# EAGLE design UnoBot (EAGLE 9.6.2)
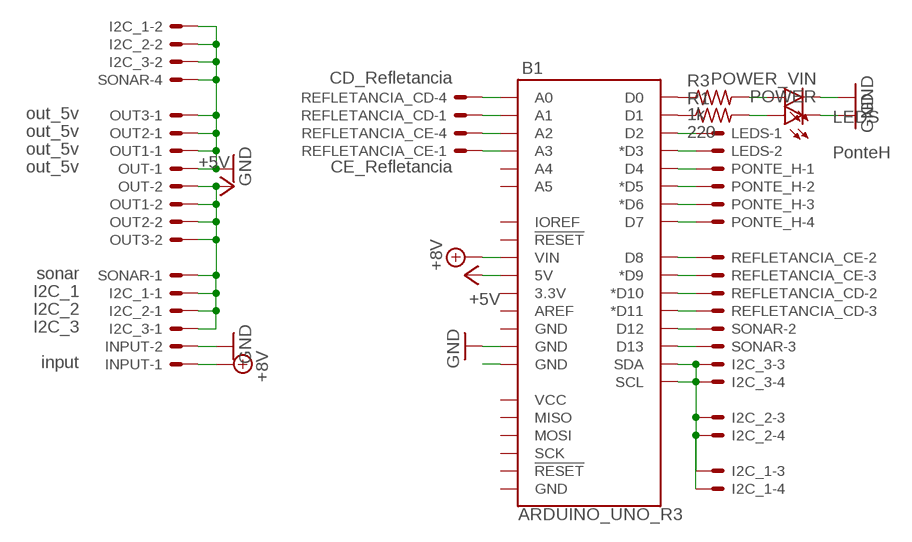
[diagram p0: schematic, sheet 1]

## Parts
B1  ARDUINO_UNO_R3  [ARDUINO_R3]
I2C_1  I2C_1  JST-XH-04-PIN-LONG-PAD  [JST-XH-04-PACKAGE-LONG-PAD]
I2C_2  I2C_2  JST-XH-04-PIN-LONG-PAD  [JST-XH-04-PACKAGE-LONG-PAD]
I2C_3  I2C_3  JST-XH-04-PIN-LONG-PAD  [JST-XH-04-PACKAGE-LONG-PAD]
INPUT  input  JST-XH-02-PIN-LONG-PAD  [JST-XH-02-PACKAGE-LONG-PAD]
LEDS  LEDS  JST-XH-02-PIN-LONG-PAD  [JST-XH-02-PACKAGE-LONG-PAD]
OUT  out_5v  JST-XH-02-PIN-LONG-PAD  [JST-XH-02-PACKAGE-LONG-PAD]
OUT1  out_5v  JST-XH-02-PIN-LONG-PAD  [JST-XH-02-PACKAGE-LONG-PAD]
OUT2  out_5v  JST-XH-02-PIN-LONG-PAD  [JST-XH-02-PACKAGE-LONG-PAD]
OUT3  out_5v  JST-XH-02-PIN-LONG-PAD  [JST-XH-02-PACKAGE-LONG-PAD]
PONTE_H  PonteH  JST-XH-04-PIN-LONG-PAD  [JST-XH-04-PACKAGE-LONG-PAD]
POWER  LEDLED5MM_LONG_PAD  [LED5MM_LONG_PAD]
POWER_VIN  LEDLED5MM_LONG_PAD  [LED5MM_LONG_PAD]
R1  220  R-US_0204/7  [0204/7]
R3  1k  R-US_0204/7  [0204/7]
REFLETANCIA_CD  CD_Refletancia  JST-XH-04-PIN-LONG-PAD  [JST-XH-04-PACKAGE-LONG-PAD]
REFLETANCIA_CE  CE_Refletancia  JST-XH-04-PIN-LONG-PAD  [JST-XH-04-PACKAGE-LONG-PAD]
SONAR  sonar  JST-XH-04-PIN-LONG-PAD  [JST-XH-04-PACKAGE-LONG-PAD]

## Nets
+5V: B1.5V I2C_1.1 I2C_2.1 I2C_3.1 OUT1.2 OUT2.2 OUT3.2 OUT.2 SONAR.1
+8V: B1.VIN INPUT.1
GND: B1.GND@3(GND) I2C_1.2 I2C_2.2 I2C_3.2 INPUT.2 OUT1.1 OUT2.1 OUT3.1 OUT.1 POWER.K(C) POWER_VIN.K(C) SONAR.4
N$1: B1.D4 PONTE_H.1
N$2: B1.D5(*D5) PONTE_H.2
N$3: B1.D6(*D6) PONTE_H.3
N$4: B1.D7 PONTE_H.4
N$5: B1.A0 REFLETANCIA_CD.4
N$6: B1.A1 REFLETANCIA_CD.1
N$7: B1.A2 REFLETANCIA_CE.4
N$8: B1.A3 REFLETANCIA_CE.1
N$9: B1.D8 REFLETANCIA_CE.2
N$10: B1.D9(*D9) REFLETANCIA_CE.3
N$11: B1.D10(*D10) REFLETANCIA_CD.2
N$12: B1.D11(*D11) REFLETANCIA_CD.3
N$13: B1.D13 SONAR.3
N$14: B1.SDA I2C_1.3 I2C_2.3 I2C_3.3
N$15: B1.D12 SONAR.2
N$16: B1.SCL I2C_1.4 I2C_2.4 I2C_3.4
N$17: B1.GND@2(GND)
N$18: B1.D2 LEDS.1
N$19: B1.D3(*D3) LEDS.2
N$20: B1.D1 R1.1
N$21: B1.D0 R3.1
N$29: POWER_VIN.A R3.2
N$32: POWER.A R1.2
Unconnected: B1.3.3V B1.A4 B1.A5 B1.AREF B1.GND@1(GND) B1.GND@4(GND) B1.IOREF B1.MISO B1.MOSI B1.RESET@1(!RESET!) B1.RESET@2(!RESET!) B1.SCK B1.VCC

## Library data of the parts
B1 = SparkFun-Boards:ARDUINO_UNO_R3: Arduino R3 Footprint with SPI header Arduino Uno R3 Compatible Footprint. Matches PCB size of the original board. SparkFun Products: SAMD21 Dev Breakout <https://www.sparkfun.com/products/13672> RedBoard <https://www.sparkfun.com/products/12757> R3 Stackable Headers <https://www.sparkfun.com/products/11417>
I2C_1-I2C_3 PONTE_H REFLETANCIA_CD REFLETANCIA_CE SONAR = Rembrandt Electronics - JST XH Connectors v1-0:JST-XH-04-PIN: JST XH Connector 2 Pin Wire to board connector. Pitch: 2,54 mm, (0.100") Number of pins: 4 Created by Rembrandt Electronics www.rembrandtelectronics.com
INPUT LEDS OUT OUT1-OUT3 = Rembrandt Electronics - JST XH Connectors v1-0:JST-XH-02-PIN: JST XH Connector 2 Pin Wire to board connector. Pitch: 2,54 mm, (0.100") Number of pins: 2 Created by Rembrandt Electronics www.rembrandtelectronics.com
POWER POWER_VIN = led_robotica:LED: LED OSRAM: - CHIPLED LG R971, LG N971, LY N971, LG Q971, LY Q971, LO R971, LY R971 LH N974, LH R974 LS Q976, LO Q976, LY Q976 LO Q996 - Hyper CHIPLED LW Q18S LB Q993, LB Q99A, LB R99A - SideLED LS A670, LO A670, LY A670, LG A670, LP A670 LB A673, LV A673, LT A673, LW A673 LH A674 LY A675 LS A676, LA A676, LO A676, LY A676, LW A676 LS A679, LY A679, LG A679 - Hyper Micro SIDELED® LS Y876, LA Y876, LO Y876, LY Y876 LT Y87S - SmartLED LW L88C, LW L88S LB L89C, LB L89S, LG L890 LS L89K, LO L89K, LY L89K LS L896, LA L896, LO L896, LY L896 - TOPLED LS T670, LO T670, LY T670, LG T670, LP T670 LSG T670, LSP T670, LSY T670, LOP T670, LYG T670 LG T671, LOG T671, LSG T671 LB T673, LV T673, LT T673, LW T673 LH T674 LS T676, LA T676, LO T676, LY T676, LB T676, LH T676, LSB T676, LW T676 LB T67C, LV T67C, LT T67C, LS T67K, LO T67K, LY T67K, LW E67C LS E67B, LA E67B, LO E67B, LY E67B, LB E67C, LV E67C, LT E67C LW T67C LS T679, LY T679, LG T679 LS T770, LO T770, LY T770, LG T770, LP T770 LB T773, LV T773, LT T773, LW T773 LH T774 LS E675, LA E675, LY E675, LS T675 LS T776, LA T776, LO T776, LY T776, LB T776 LHGB T686 LT T68C, LB T68C - Hyper Mini TOPLED® LB M676 - Mini TOPLED Santana® LG M470 LS M47K, LO M47K, LY M47K Source: http://www.osram.convergy.de LUXEON: - LUMILED® LXK2-PW12-R00, LXK2-PW12-S00, LXK2-PW14-U00, LXK2-PW14-V00 LXK2-PM12-R00, LXK2-PM12-S00, LXK2-PM14-U00 LXK2-PE12-Q00, LXK2-PE12-R00, LXK2-PE12-S00, LXK2-PE14-T00, LXK2-PE14-U00 LXK2-PB12-K00, LXK2-PB12-L00, LXK2-PB12-M00, LXK2-PB14-N00, LXK2-PB14-P00, LXK2-PB14-Q00 LXK2-PR12-L00, LXK2-PR12-M00, LXK2-PR14-Q00, LXK2-PR14-R00 LXK2-PD12-Q00, LXK2-PD12-R00, LXK2-PD12-S00 LXK2-PH12-R00, LXK2-PH12-S00 LXK2-PL12-P00, LXK2-PL12-Q00, LXK2-PL12-R00 Source: www.luxeon.com KINGBRIGHT: KA-3528ASYC Source: www.kingbright.com
R1 R3 = rcl_robotica:R-US_: RESISTOR, American symbol; SPICEPREFIX: R

## Board
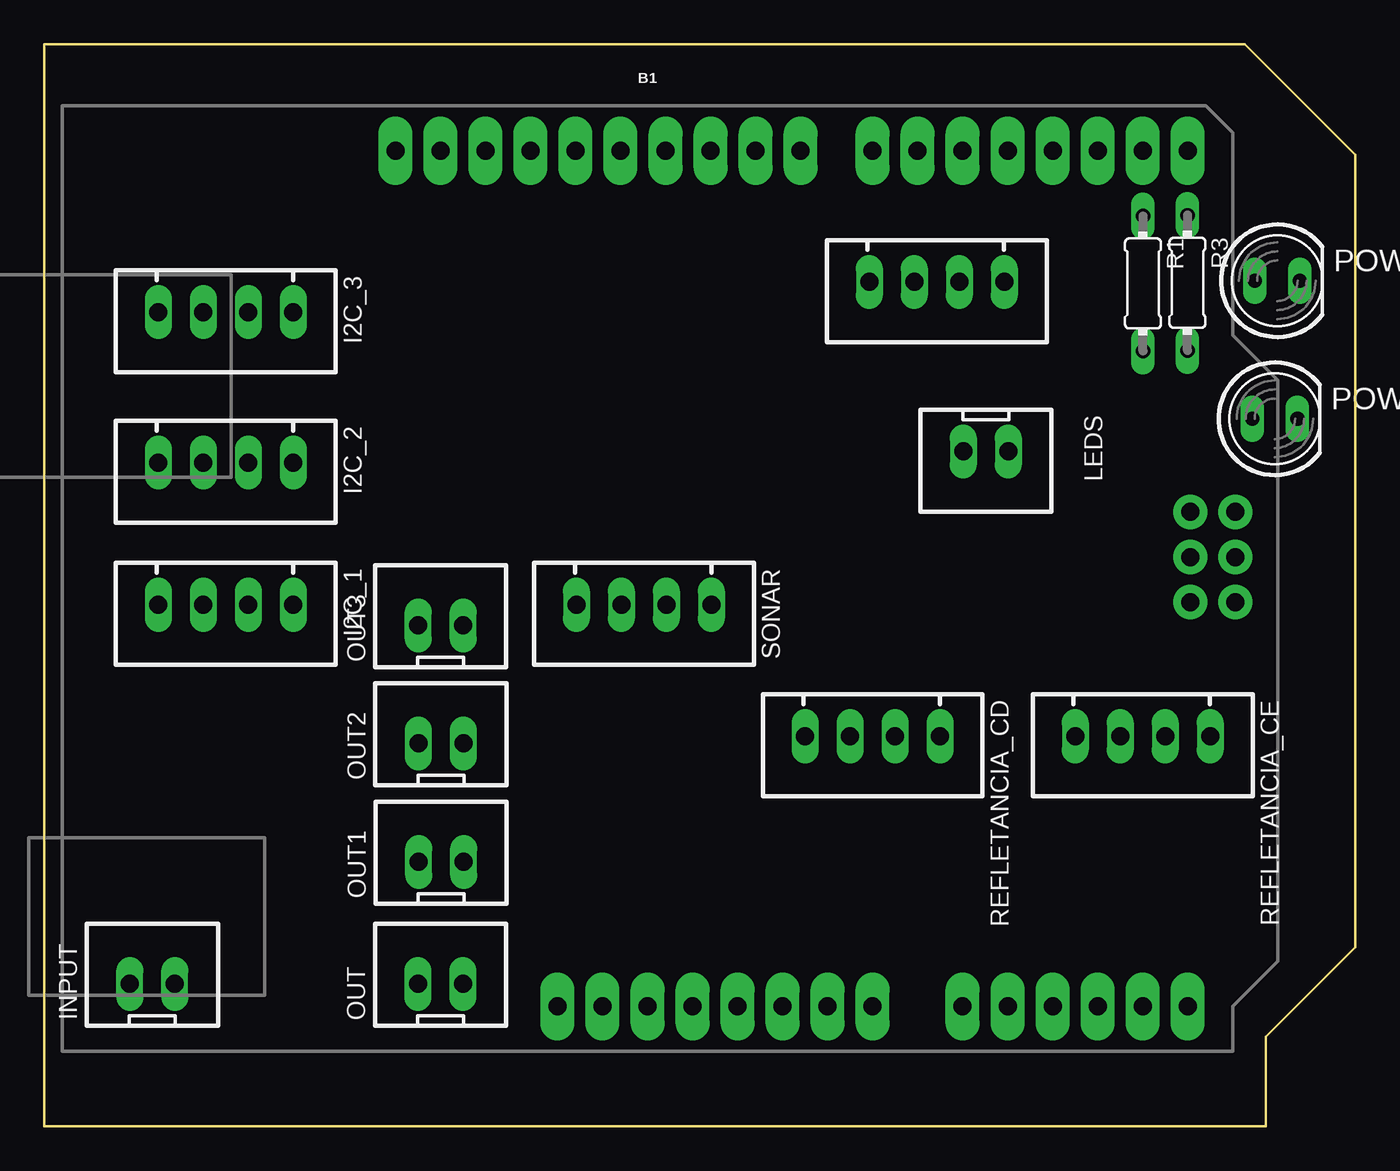
[diagram p1: board, top side]
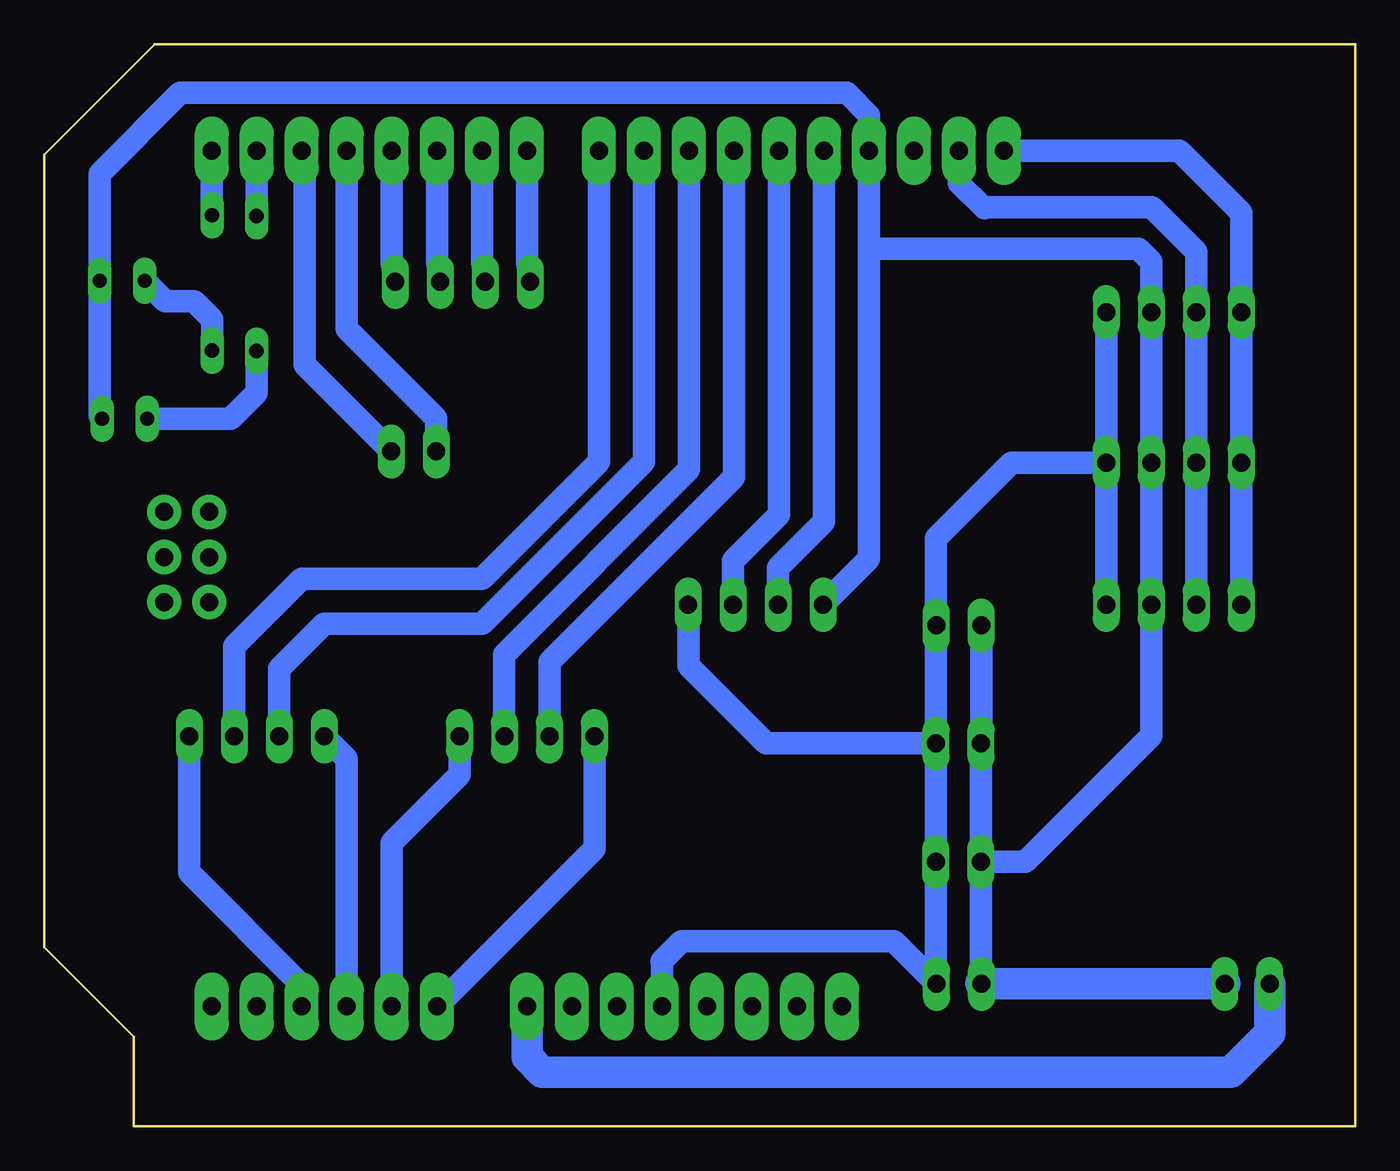
[diagram p2: board, bottom side, seen from below]

Size 73.96 x 61.04 mm. Coordinates in mm from the lower left corner, seen from the top.
Outline: 0,61.04 0,0 68.91,0 68.91,5.05 73.97,10.11 73.97,54.8 67.73,61.04 0,61.04
Copper layers (1*16): Top 0.035mm / dielectric 1.5mm / Bottom 0.035mm
Design rules "default *": minimum track width 6mil, minimum drill 0.35mm, track to track 6mil, track to pad 6mil, pad to pad 6mil, via to via 6mil, smd to smd 6mil, copper to edge 40mil, drill to drill 6mil, minimum pad ring 10mil, minimum via ring 8mil, stop-mask expansion 4mil, vias tented up to drill 0mil, thermal gap 10mil

### Footprints (pad centres in the part's own frame; a part is rotated, then mirrored left to right if it is on the bottom)
ARDUINO_R3 = drill 1.016 pad 1.93 long: 3.3V 2.54,-24.13; 5V 5.08,-24.13; A0 17.78,-24.13; A1 20.32,-24.13; A2 22.86,-24.13; A3 25.4,-24.13; A4 27.94,-24.13; A5 30.48,-24.13; AREF -9.144,24.13; D0 30.48,24.13; D1 27.94,24.13; D2 25.4,24.13; D3 22.86,24.13; D4 20.32,24.13; D5 17.78,24.13; D6 15.24,24.13; D7 12.7,24.13; D8 8.636,24.13; D9 6.096,24.13; D10 3.556,24.13; D11 1.016,24.13; D12 -1.524,24.13; D13 -4.064,24.13; GND@1 7.62,-24.13; GND@2 10.16,-24.13; GND@3 -6.604,24.13; IOREF -2.54,-24.13; NC -5.08,-24.13; RESET@1 0,-24.13; SCL -14.224,24.13; SDA -11.684,24.13; VIN 12.7,-24.13 | drill 1.016 pad 1.93: GND@4 33.16,-1.32; MISO 30.62,3.76; MOSI 33.16,1.22; RESET@2 30.62,-1.32; SCK 30.62,1.22; VCC 33.16,3.76
JST-XH-04-PACKAGE-LONG-PAD = drill 1.016 long: 1 -3.81,0; 2 -1.27,0; 3 1.27,0; 4 3.81,0
JST-XH-02-PACKAGE-LONG-PAD = drill 1.016 long: 1 -1.27,0; 2 1.27,0
LED5MM_LONG_PAD = drill 0.813 long: A -1.27,0; K 1.27,0
0204/7 = drill 0.813 long: 1 -3.81,0; 2 3.81,0

### Placement (x,y rotation side)
B1  34.04,30.9 0 top
I2C_1  10.24,29.43 180 top
I2C_2  10.24,37.44 180 top
I2C_3  10.24,45.94 180 top
INPUT  6.1,8.04 0 top
LEDS  53.12,38.07 180 top
OUT  22.35,8.04 0 top
OUT1  22.39,14.92 0 top
OUT2  22.38,21.6 0 top
OUT3  22.36,28.26 0 top
PONTE_H  50.36,47.64 180 top
POWER  69.43,39.92 0 top
POWER_VIN  69.57,47.7 0 top
R1  61.99,47.55 270 top
R3  64.5,47.59 270 top
REFLETANCIA_CD  46.74,22.01 180 top
REFLETANCIA_CE  61.98,22.01 180 top
SONAR  33.83,29.43 180 top

### Tracks (layer width: path | path; a pad name or v marks a point on that pad's centre or on a via)
+5V
  Bottom 1.27: B1.5V 39.12,9.31 39.13,9.32 38.01,10.44 26.02,10.44 OUT.2 23.66,8.08 OUT1.2 23.66,21.59 OUT2.2 | I2C_3.1 I2C_2.1 | I2C_2.1 I2C_1.1 | SONAR.1 37.62,29.4 37.62,25.98 33.24,21.6 OUT2.2 | OUT3.2 23.65,28.25 | 23.65,28.25 OUT2.2 | I2C_2.1 19.39,37.44 23.65,33.19 23.65,28.25
+8V
  Bottom 1.778: INPUT.1 4.83,5.26 7.02,3.06 45.87,3.06 46.74,3.92 B1.VIN
GND
  Bottom 1.27: OUT1.1 21.12,8.08 | OUT1.1 21.11,14.94 OUT2.1 21.09,21.62 OUT3.1 | SONAR.4 27.43,32.02 27.43,49.49 | 27.43,49.49 B1.GND@3 27.43,57.04 28.68,58.29 66.29,58.29 70.84,53.74 POWER_VIN.K 70.84,40.06 POWER.K | OUT1.1 18.62,14.92 11.51,22.03 I2C_1.2 I2C_2.2 I2C_3.2 11.51,48.77 12.23,49.49 27.43,49.49
  Bottom 1.778: INPUT.2 OUT.1 21.12,8.08
N$1
  Bottom 1.27: B1.D4 54.36,48.78 PONTE_H.1
N$2
  Bottom 1.27: B1.D5 51.82,48.78 PONTE_H.2
N$3
  Bottom 1.27: B1.D6 49.28,48.78 PONTE_H.3
N$4
  Bottom 1.27: B1.D7 46.74,48.78 PONTE_H.4
N$5
  Bottom 1.27: REFLETANCIA_CD.4 42.93,15.66 B1.A0
N$6
  Bottom 1.27: REFLETANCIA_CD.1 50.55,19.83 54.36,16.02 B1.A1
N$7
  Bottom 1.27: REFLETANCIA_CE.4 56.9,20.74 B1.A2
N$8
  Bottom 1.27: REFLETANCIA_CE.1 65.79,16.43 65.79,14.33 59.44,7.98 B1.A3
N$9
  Bottom 1.27: REFLETANCIA_CE.2 63.25,27.09 59.44,30.9 49.28,30.9 42.67,37.5 B1.D8
N$10
  Bottom 1.27: REFLETANCIA_CE.3 60.71,25.82 58.17,28.36 49.28,28.36 40.13,37.5 B1.D9
N$11
  Bottom 1.27: B1.D10 37.59,37.06 48.03,26.62 48.03,22.03 REFLETANCIA_CD.2
N$12
  Bottom 1.27: REFLETANCIA_CD.3 45.47,26.21 35.05,36.63 B1.D11
N$13
  Bottom 1.27: SONAR.3 32.56,31.51 29.97,34.1 B1.D13
N$14
  Bottom 1.27: I2C_1.3 I2C_2.3 I2C_3.3 8.97,49.34 11.48,51.85 20.84,51.85 20.92,51.78 22.35,53.21 B1.SDA
N$15
  Bottom 1.27: SONAR.2 35.1,31.9 32.51,34.49 B1.D12
N$16
  Bottom 1.27: I2C_3.4 I2C_2.4 I2C_1.4 | I2C_3.4 6.33,46.04 | I2C_3.4 6.43,51.54 9.92,55.03 B1.SCL
N$18
  Bottom 1.27: LEDS.1 59.27,42.95 59.27,54.86 B1.D2
N$19
  Bottom 1.27: B1.D3 56.9,44.98 51.85,39.94 LEDS.2
N$20
  Bottom 1.27: B1.D1 61.99,55.02 R1.1
N$21
  Bottom 1.27: B1.D0 R3.1
N$29
  Bottom 1.27: POWER_VIN.A 67.15,46.55 65.52,46.55 64.5,45.53 R3.2
N$32
  Bottom 1.27: R1.2 61.99,41.38 63.45,39.92 POWER.A